# Altium schematic sheet Port_Power.SchDoc: Port Power
size 431 x 279 mm; Author: Eric Liu; SheetNumber: 4; SheetTotal: 9
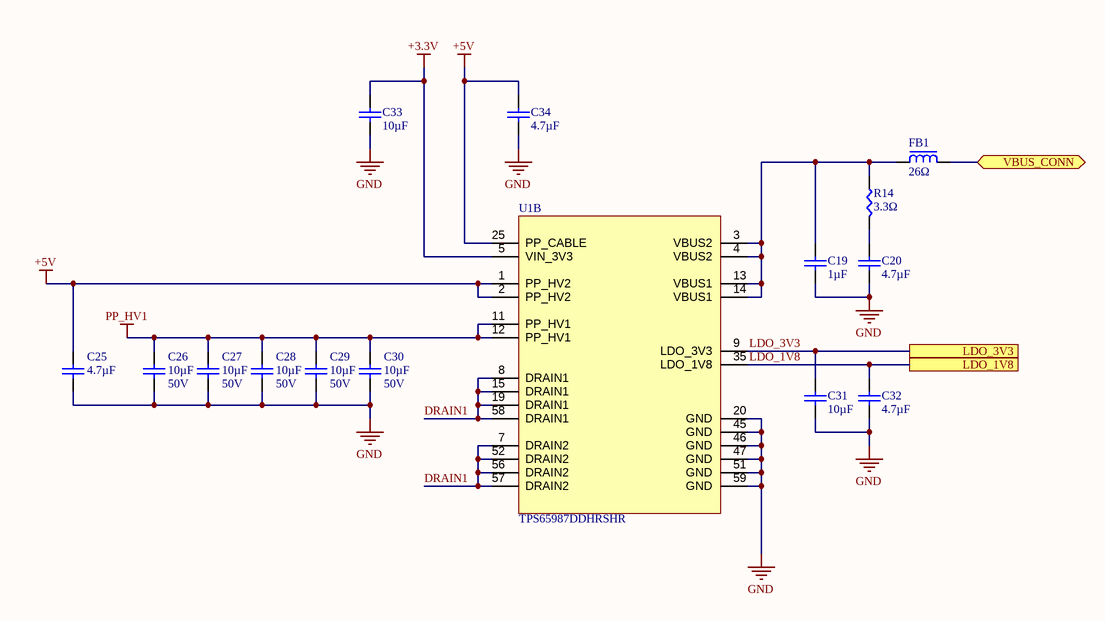
[diagram p0: Port_Power.SchDoc]

## Parts
C19  value 1µF  [CAP0402]  (hidden comment: GRM155R61H105KE05D)
C20  value 4.7µF  [CAP0805]  (hidden comment: GRT21BR61H475KE13L)
C25  value 4.7µF  [CAP0805]  (hidden comment: GRT21BR61H475KE13L)
C26  value 10µF  Voltage: 50V  [CAP1206]  (hidden comment: CL31A106KBHNNNE)
C27  value 10µF  Voltage: 50V  [CAP1206]  (hidden comment: CL31A106KBHNNNE)
C28  value 10µF  Voltage: 50V  [CAP1206]  (hidden comment: CL31A106KBHNNNE)
C29  value 10µF  Voltage: 50V  [CAP1206]  (hidden comment: CL31A106KBHNNNE)
C30  value 10µF  Voltage: 50V  [CAP1206]  (hidden comment: CL31A106KBHNNNE)
C31  value 10µF  [CAP0402]  (hidden comment: CL05A106MQ5NUNC)
C32  value 4.7µF  [CAP0805]  (hidden comment: GRT21BR61H475KE13L)
C33  value 10µF  [CAP0402]  (hidden comment: CL05A106MQ5NUNC)
C34  value 4.7µF  [CAP0805]  (hidden comment: GRT21BR61H475KE13L)
FB1  value 26Ω  (hidden comment: BLM18SG260TN1D)
R14  value 3.3Ω  [RES0402]  (hidden comment: ESR10EZPJ3R3)
U1  TPS65987DDHRSHR  [56-VQFN (7x7)]  (part B of 2)

## Ports
LDO_1V8, LDO_3V3, VBUS_CONN (bidir)

## Nets
+3.3V: C33.2 U1.5(VIN_3V3)
+5V: C25.1 C34.2 U1.1(PP_HV2) U1.2(PP_HV2) U1.25(PP_CABLE)
GND: C19.1 C20.1 C25.2 C26.1 C27.1 C28.1 C29.1 C30.1 C31.1 C32.1 C33.1 C34.1 U1.20(GND) U1.45(GND) U1.46(GND) U1.47(GND) U1.51(GND) U1.59(GND)
PP_HV1: C26.2 C27.2 C28.2 C29.2 C30.2 U1.11(PP_HV1) U1.12(PP_HV1)
DRAIN1: U1.7(DRAIN2) U1.8(DRAIN1) U1.15(DRAIN1) U1.19(DRAIN1) U1.52(DRAIN2) U1.56(DRAIN2) U1.57(DRAIN2) U1.58(DRAIN1)
LDO_1V8: C32.2 U1.35(LDO_1V8) ; port LDO_1V8
LDO_3V3: C31.2 U1.9(LDO_3V3) ; port LDO_3V3
VBUS_CONN: FB1.2 ; port VBUS_CONN
NetC19_2: C19.2 FB1.1 R14.2 U1.3(VBUS2) U1.4(VBUS2) U1.13(VBUS1) U1.14(VBUS1)
NetC20_2: C20.2 R14.1

## Notes on the sheet
- DWG. NO.
- REV.
- SHT.
- THIS DOCUMENT AND THE DATA DISCLOSED HEREIN OR HEREWITH IS THE PROPERTY OF ALTIUM LIMITED AND MAY BE FREELY DISTRIBUTED IN WHOLE. NO RIGHTS ARE RESERVED OR EXPRESS OR IMPLIED WARANTEE GIVEN.
- REVISION
- DESCRIPTION
- DATE
- APPROVED
- ENG:
- APPROVALS
- PROJECT
- DSN:
- CHK:
- REFERENCE DOCUMENTS
- PROJECT REVISION:
- TITLE
- DOCUMENT REVISION:
- DESIGN ITEM:
- BOM:
- FAB DWG:
- PCB DWG:
- ASSY DWG:
- SCALE:
- SIZE
- B
- CAGE CODE
- FILE NAME
- DWG NO.
- SHEET
- OF
- REV

## Library data of the parts
C19 = GRM155R61H105KE05D: 1 µF ±10% 50V Ceramic Capacitor X5R 0402 (1005 Metric); Temperature Coefficient: X5R; Package: 0402 (1005 Metric); Voltage: 50V
C20 C25 C32 C34 = GRT21BR61H475KE13L: 4.7 µF ±10% 50V Ceramic Capacitor X5R 0805 (2012 Metric); Temperature Coefficient: X5R; Package: 0402 (1005 Metric); Voltage: 50V
C26-C30 = CL31A106KBHNNNE: 10 µF ±10% 50V Ceramic Capacitor X5R 1206 (3216 Metric); Temperature Coefficient: X5R; Package: 1206 (3216 Metric)
C31 C33 = CL05A106MQ5NUNC: 10 µF ±20% 6.3V Ceramic Capacitor X5R 0402 (1005 Metric); Temperature Coefficient: C0G, NP0; Package: 0402 (1005 Metric); Voltage: 6.3V
FB1 = BLM18SG260TN1D: 26 Ohms @ 100 MHz 1 Power Line Ferrite Bead 0603 (1608 Metric) 6A 7mOhm; Manufacturer 1: Murata Electronics; Manufacturer Part Number 1: BLM18SG260TN1D; Supplier Part Number 1: 490-3995-1-ND; Supplier 1: Digi-Key; Current Rating: 6A
R14 = ESR10EZPJ3R3: 3.3 Ohms ±5% 0.5W, 1/2W Chip Resistor 0805 (2012 Metric) Automotive AEC-Q200, Pulse Withstanding Thick Film; Manufacturer 1: Rohm Semiconductor; Manufacturer Part Number 1: ESR10EZPJ3R3; Supplier Part Number 1: RHM3.3KCT-ND; Supplier 1: Digi-Key; Power Rating: 1/2W
U1 = TPS65987DDHRSHR: USB, Type-C Controller PMIC 56-VQFN (7x7); Manufacturer: Texas Instruments; Standards: USB4 PD 3.0; Manufacturer Product Number: TPS65987DDHRSHR; Supplier: DigiKey; Supplier Part Number: 296-52067-1-ND; Datasheet: https://www.ti.com/lit/ds/symlink/tps65987d.pdf?HQS=dis-dk-null-digikeymode-dsf-pf-null-wwe&ts=1769374030059; Operating Temperature: -10°C ~ 75°C